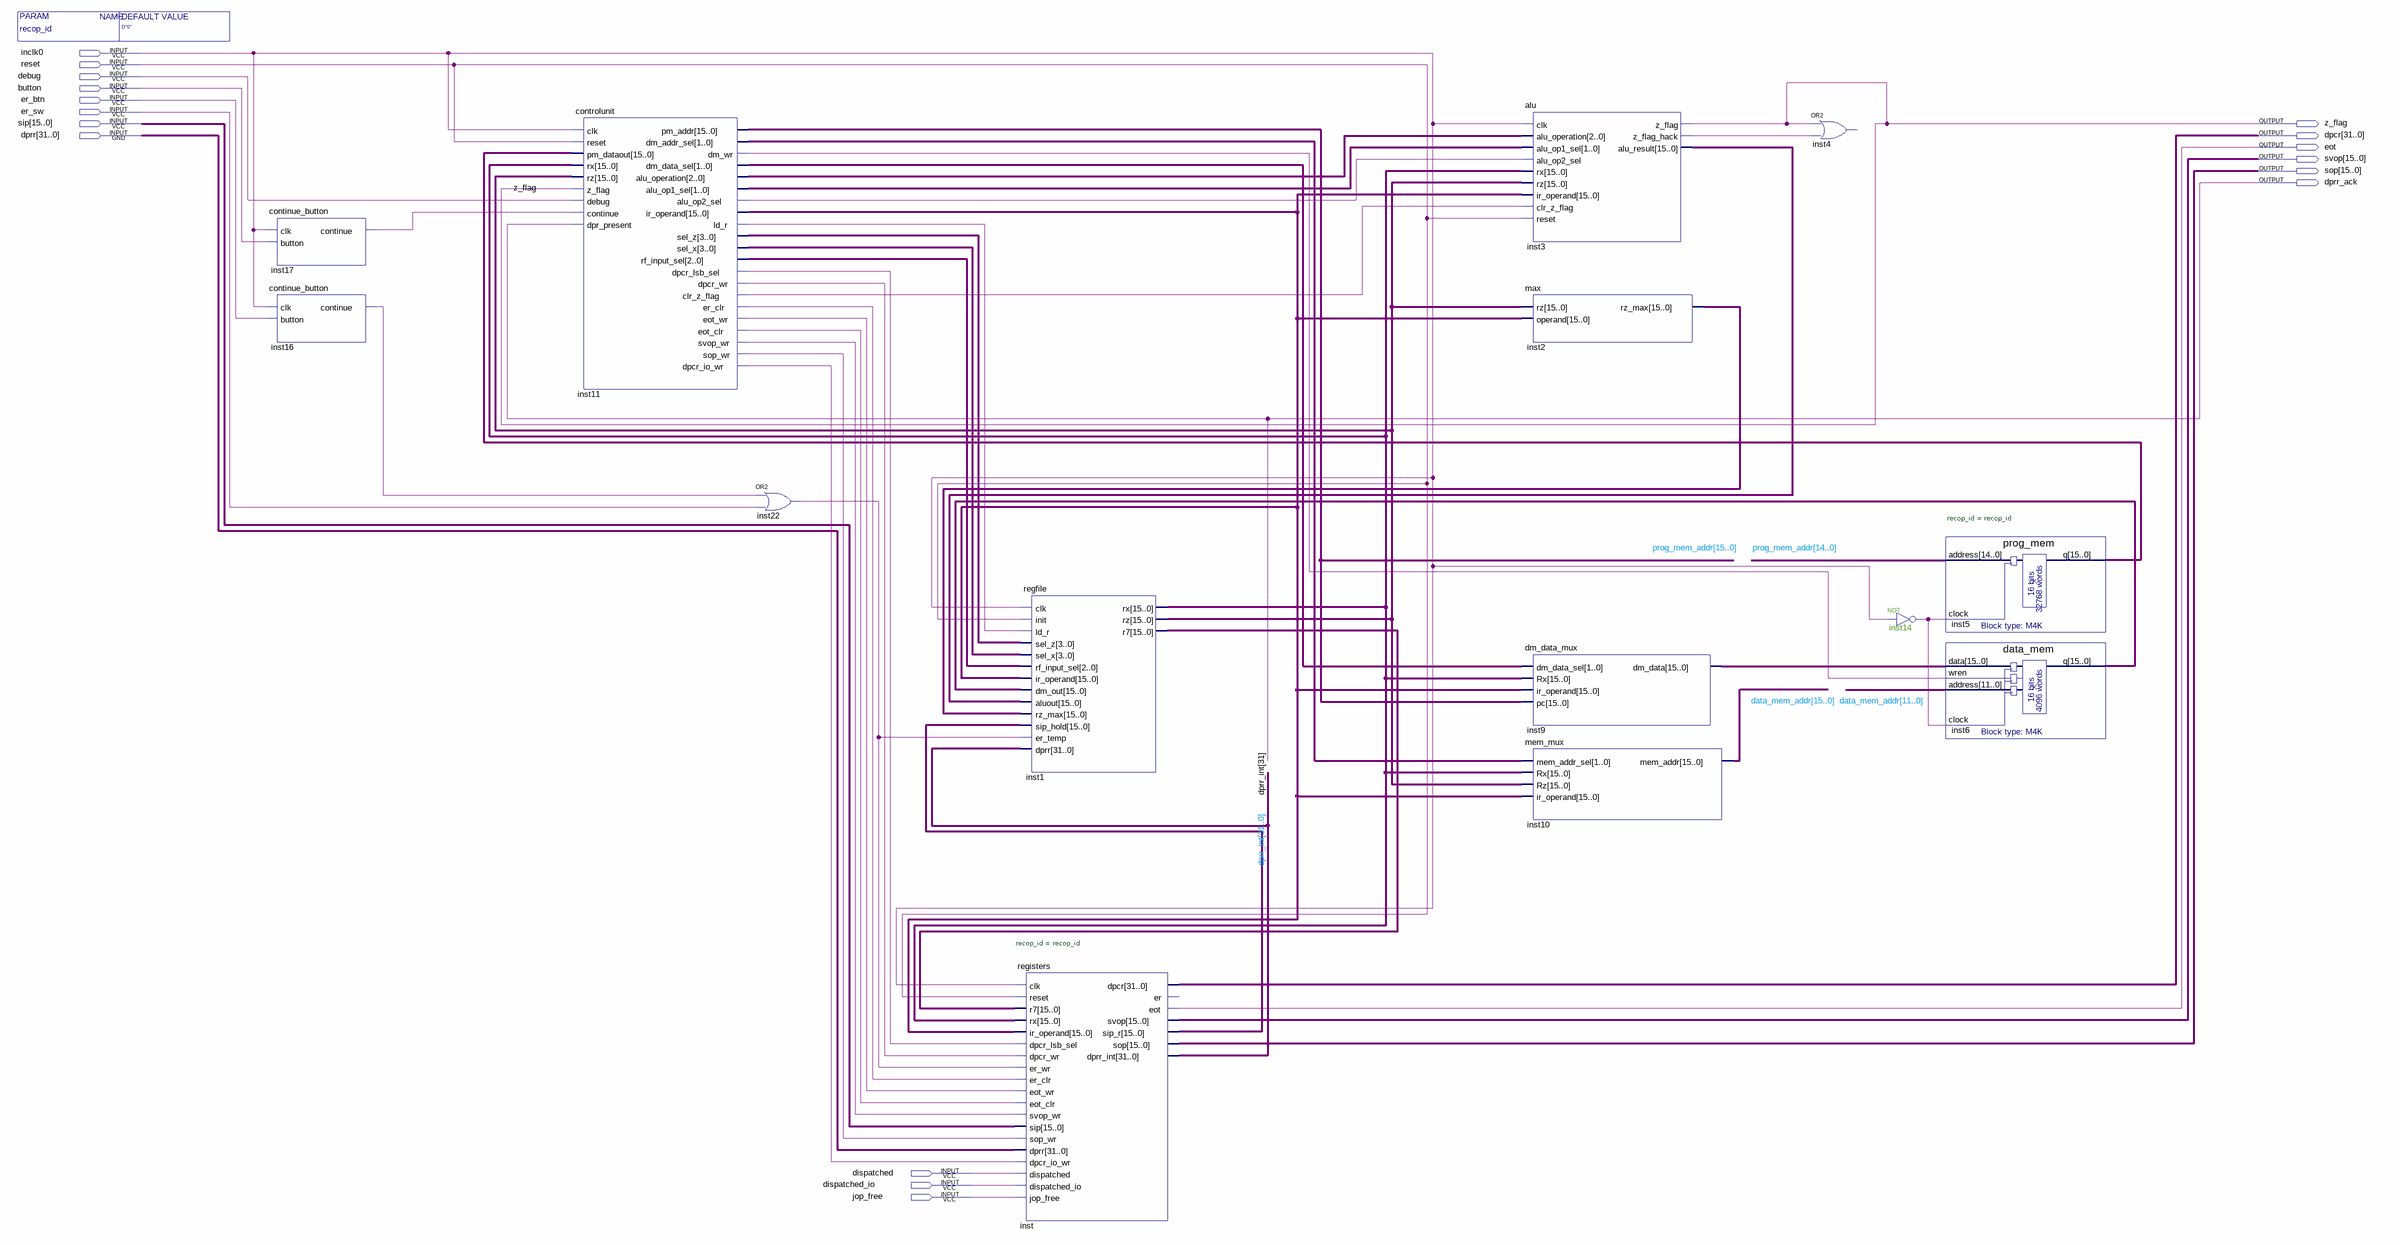
[diagram p0: schematic sheet]
// Quartus schematic ReCOPv2.bdf as structural Verilog: 14 symbols, 17 pins
module ReCOPv2 #(parameter recop_id = "D\"0\"") (
  input  inclk0,
  input  reset,
  input  debug,
  input  button,
  input  er_btn,
  input  er_sw,
  input  [15:0] sip,
  input  [31:0] dprr,
  input  dispatched,
  input  dispatched_io,
  input  jop_free,
  output z_flag,
  output [31:0] dpcr,
  output eot,
  output [15:0] svop,
  output [15:0] sop,
  output dprr_ack
);

  wire inst3_z_flag_hack, inst11_alu_op2_sel, inst11_clr_z_flag, inst11_dm_wr, inst11_dpcr_io_wr,
       inst11_dpcr_lsb_sel, inst11_dpcr_wr, inst11_eot_clr, inst11_eot_wr, inst11_er_clr, inst11_ld_r,
       inst11_sop_wr, inst11_svop_wr, inst14_out, inst16_continue, inst17_continue, inst22_out;
  wire [1:0] inst11_alu_op1_sel, inst11_dm_addr_sel, inst11_dm_data_sel;
  wire [2:0] inst11_alu_operation, inst11_rf_input_sel;
  wire [3:0] inst11_sel_x, inst11_sel_z;
  wire [15:0] data_mem_addr, inst1_r7, inst1_rx, inst1_rz, inst2_rz_max, inst3_alu_result, inst5_q, inst6_q,
       inst9_dm_data, inst11_ir_operand, inst_sip_r, prog_mem_addr;
  wire [30:0] dprr_int;

  continue_button inst17 (.clk(inclk0), .button(button), .\continue (inst17_continue));
  continue_button inst16 (.clk(inclk0), .button(er_btn), .\continue (inst16_continue));
  controlunit inst11 (
    .clk(inclk0), .reset(reset), .pm_dataout(inst5_q), .rx(inst1_rx), .rz(inst1_rz), .z_flag(z_flag),
    .debug(debug), .\continue (inst17_continue), .dpr_present(dprr_ack), .pm_addr(prog_mem_addr),
    .dm_addr_sel(inst11_dm_addr_sel), .dm_wr(inst11_dm_wr), .dm_data_sel(inst11_dm_data_sel),
    .alu_operation(inst11_alu_operation), .alu_op1_sel(inst11_alu_op1_sel), .alu_op2_sel(inst11_alu_op2_sel),
    .ir_operand(inst11_ir_operand), .ld_r(inst11_ld_r), .sel_z(inst11_sel_z), .sel_x(inst11_sel_x),
    .rf_input_sel(inst11_rf_input_sel), .dpcr_lsb_sel(inst11_dpcr_lsb_sel), .dpcr_wr(inst11_dpcr_wr),
    .clr_z_flag(inst11_clr_z_flag), .er_clr(inst11_er_clr), .eot_wr(inst11_eot_wr), .eot_clr(inst11_eot_clr),
    .svop_wr(inst11_svop_wr), .sop_wr(inst11_sop_wr), .dpcr_io_wr(inst11_dpcr_io_wr));
  or inst22 (inst22_out, inst16_continue, er_sw);
  regfile inst1 (
    .clk(inclk0), .init(reset), .ld_r(inst11_ld_r), .sel_z(inst11_sel_z), .sel_x(inst11_sel_x),
    .rf_input_sel(inst11_rf_input_sel), .ir_operand(inst11_ir_operand), .dm_out(inst6_q),
    .aluout(inst3_alu_result), .rz_max(inst2_rz_max), .sip_hold(inst_sip_r), .er_temp(inst22_out),
    .dprr({dprr_ack, dprr_int}), .rx(inst1_rx), .rz(inst1_rz), .r7(inst1_r7));
  registers #(.recop_id(recop_id)) inst (
    .clk(inclk0), .reset(reset), .r7(inst1_r7), .rx(inst1_rx), .ir_operand(inst11_ir_operand),
    .dpcr_lsb_sel(inst11_dpcr_lsb_sel), .dpcr_wr(inst11_dpcr_wr), .er_wr(inst22_out), .er_clr(inst11_er_clr),
    .eot_wr(inst11_eot_wr), .eot_clr(inst11_eot_clr), .svop_wr(inst11_svop_wr), .sip(sip),
    .sop_wr(inst11_sop_wr), .dprr(dprr), .dpcr_io_wr(inst11_dpcr_io_wr), .dispatched(dispatched),
    .dispatched_io(dispatched_io), .jop_free(jop_free), .dpcr(dpcr), .eot(eot), .svop(svop),
    .sip_r(inst_sip_r), .sop(sop), .dprr_int({dprr_ack, dprr_int}));  // open: er
  alu inst3 (
    .clk(inclk0), .alu_operation(inst11_alu_operation), .alu_op1_sel(inst11_alu_op1_sel),
    .alu_op2_sel(inst11_alu_op2_sel), .rx(inst1_rx), .rz(inst1_rz), .ir_operand(inst11_ir_operand),
    .clr_z_flag(inst11_clr_z_flag), .reset(reset), .z_flag(z_flag), .z_flag_hack(inst3_z_flag_hack),
    .alu_result(inst3_alu_result));
  max inst2 (.rz(inst1_rz), .operand(inst11_ir_operand), .rz_max(inst2_rz_max));
  dm_data_mux inst9 (
    .dm_data_sel(inst11_dm_data_sel), .Rx(inst1_rx), .ir_operand(inst11_ir_operand), .pc(prog_mem_addr),
    .dm_data(inst9_dm_data));
  mem_mux inst10 (
    .mem_addr_sel(inst11_dm_addr_sel), .Rx(inst1_rx), .Rz(inst1_rz), .ir_operand(inst11_ir_operand),
    .mem_addr(data_mem_addr));
  // OR2 inst4 has open pins: IN1=z_flag, IN2=inst3_z_flag_hack, OUT=open
  not inst14 (inst14_out, inclk0);
  prog_mem #(.recop_id(recop_id)) inst5 (.address(prog_mem_addr[14:0]), .clock(inst14_out), .q(inst5_q));
  data_mem inst6 (
    .data(inst9_dm_data), .wren(inst11_dm_wr), .address(data_mem_addr[11:0]), .clock(inst14_out), .q(inst6_q));

  // Other names for the same wires on the sheet: dprr_int[31] = dprr_ack
endmodule
